# EAGLE design attiny_driver (EAGLE 6.2)
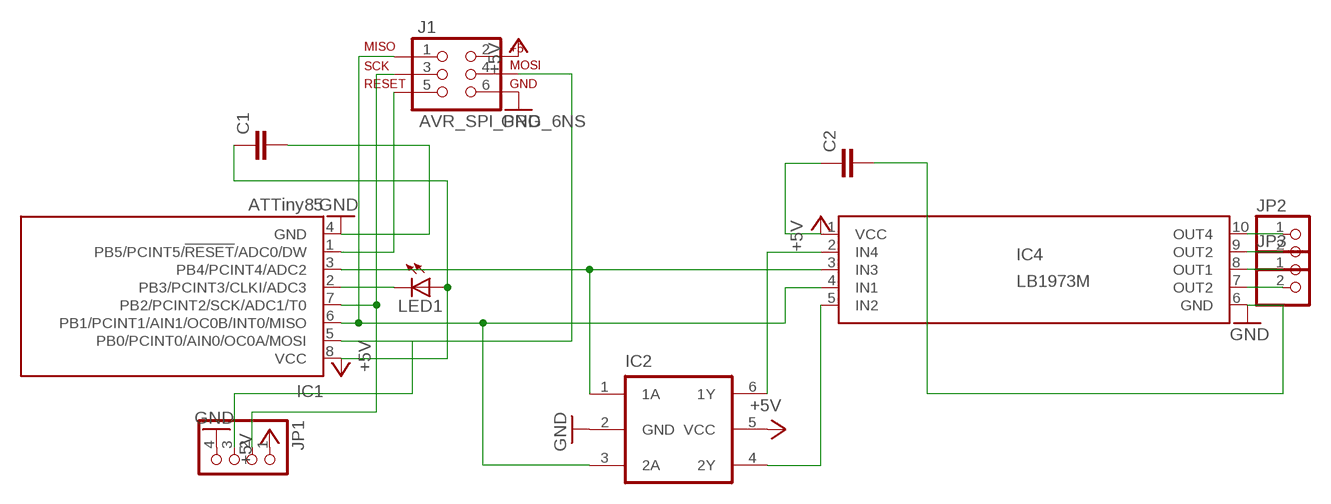
[diagram p0: schematic, sheet 1]

## Parts
C1  C-EUC0805  [C0805]
C2  C-EUC0805  [C0805]
IC1  ATTiny85  TINY13-20SU  [8S2]
IC2  IC_BUFF_SN74LVC2G17DBV  [DBV-R-PDSO-G6]
IC4  LB1973M  [SSOP10]
J1  AVR_SPI_PRG_6NS  [2X3-NS]
JP1  PINHD-1X4  [1X04]
JP2  PINHD-1X2  [1X02]
JP3  PINHD-1X2  [1X02]
LED1  LED0603  [LED-0603]

## Nets
+5V [PWR]: C1.1 C2.1 IC1.8(VCC) IC2.5(VCC) IC4.1(VCC) J1.2 JP1.1 LED1.A
GND [PWR]: C1.2 C2.2 IC1.4(GND) IC2.2(GND) IC4.6(GND) J1.6 JP1.4
IN1/MISO: IC1.6(PB1/PCINT1/AIN1/OC0B/INT0/MISO) IC2.3(2A) IC4.4(IN1) J1.1
IN2: IC2.4(2Y) IC4.5(IN2)
IN3: IC1.3(PB4/PCINT4/ADC2) IC2.1(1A) IC4.3(IN3)
IN4: IC2.6(1Y) IC4.2(IN4)
N$3: IC1.2(PB3/PCINT3/CLKI/ADC3) LED1.C
N$6: IC1.1(PB5/PCINT5/!RESET!/ADC0/DW) J1.5
OUT1 [PWR]: IC4.8(OUT1) JP3.1
OUT2 [PWR]: IC4.7(OUT2) JP3.2
OUT3 [PWR]: IC4.9(OUT2) JP2.2
OUT4 [PWR]: IC4.10(OUT4) JP2.1
SCL/SCK: IC1.7(PB2/PCINT2/SCK/ADC1/T0) J1.3 JP1.2
SDA/MOSI: IC1.5(PB0/PCINT0/AIN0/OC0A/MOSI) J1.4 JP1.3

## Library data of the parts
C1 C2 = rcl:C-EU: CAPACITOR, European symbol
IC1 = atmel:TINY13: 8-bit AVR Microcontroller with 1K Bytes In-System Programmable Flash Source: http://www.atmel.com/dyn/resources/prod_documents/2535S.pdf; MPN: ATTINY13-20SU; OC_FARNELL: 9171568; OC_NEWARK: 96K6522
IC2 = dp_devices:IC_BUFF_SN74LVC2G17
IC4 = LB1973M:LB1973M: edit this description Auto generated by make-symbol-device-package-bsdl.ulp Rev. 43 Source:
J1 = SparkFun-Connectors:AVR_SPI_PRG_6: AVR ISP 6 Pin This is the reduced ISP connector for AVR programming. Common on Arduino. This footprint will take up less PCB space and can be used with a 10-pin to 6-pin adapter such as SKU: BOB-08508
JP1 = pinhead:PINHD-1X4: PIN HEADER
JP2 JP3 = pinhead:PINHD-1X2: PIN HEADER
LED1 = SparkFun-LED:LED: LEDs Standard schematic elements and footprints for 5mm, 3mm, 1206, and 0603 sized LEDs. 5mm - Spark Fun Electronics SKU : COM-00529 (and others)

## Net classes
1 PWR: width 0.203 mm

## Board
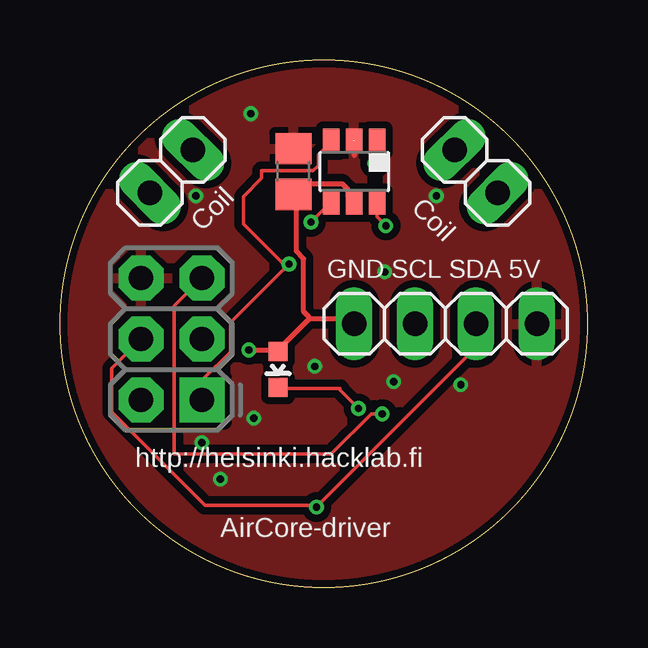
[diagram p1: board, top side]
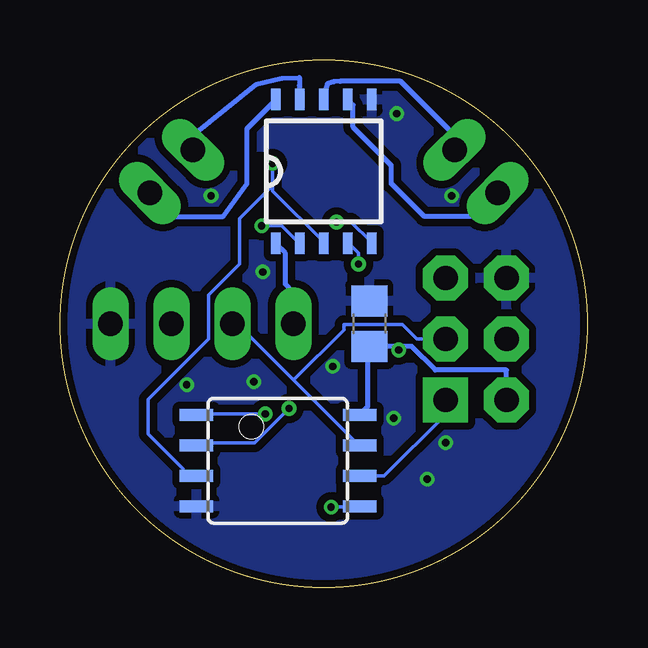
[diagram p2: board, bottom side, seen from below]

Size 22 x 22 mm. Coordinates in mm from the lower left corner, seen from the top.
Outline: circle at 11,11 radius 11
Copper layers (1*16): Top 0.035mm / dielectric 1.5mm / Bottom 0.035mm
Design rules: minimum track width 6mil, minimum drill 12mil, track to track 6mil, track to pad 6mil, pad to pad 6mil, via to via 6mil, smd to smd 0mil, copper to edge 10mil, drill to drill 10mil, minimum pad ring 10mil, minimum via ring 6mil, stop-mask expansion 2mil, vias tented up to drill 100mil, thermal gap 10mil

### Footprints (pad centres in the part's own frame; a part is rotated, then mirrored left to right if it is on the bottom)
C0805 = smd 1.3 x 1.5: 1 -0.95,0; 2 0.95,0
8S2 = smd 0.5 x 1.4: 1 -1.905,-3.404; 2 -0.645,-3.404; 3 0.625,-3.404; 4 1.895,-3.404; 5 1.905,3.404; 6 0.635,3.404; 7 -0.635,3.404; 8 -1.905,3.404
DBV-R-PDSO-G6 = smd 0.69 x 0.99: 1 -0.95,-1.29; 2 0,-1.29; 3 0.95,-1.29; 4 0.95,1.3; 5 0,1.3; 6 -0.95,1.3
SSOP10 = smd 0.9 x 0.4: 1 -2.996,2; 2 -2.996,1; 3 -2.996,0; 4 -2.996,-1; 5 -2.996,-2; 6 2.996,-2; 7 2.996,-1; 8 2.996,0; 9 2.996,1; 10 2.996,2
2X3-NS = drill 1.016 pad 1.88 square: 1 -2.54,-1.27 | drill 1.016 pad 1.88 octagon: 2 -2.54,1.27; 3 0,-1.27; 4 0,1.27; 5 2.54,-1.27; 6 2.54,1.27
1X04 = drill 1.016 long: 1 -3.81,0; 2 -1.27,0; 3 1.27,0; 4 3.81,0
1X02 = drill 1.016 long: 1 -1.27,0; 2 1.27,0
LED-0603 = smd 0.8 x 0.8: A 0,-0.75; C 0,0.75

### Placement (x,y rotation side)
C1  9.1,11 90 bottom
C2  9.73,17.35 90 top
IC1  12.91,5.29 270 bottom
IC2  12.27,17.35 180 top
IC4  11,17.35 90 bottom
J1  4.65,10.37 90 top
JP1  16.08,11 0 top
JP2  17.35,17.35 135 top
JP3  4.65,17.35 225 top
LED1  9.1,9.1 180 top

### Tracks (layer width: path | path; a pad name or v marks a point on that pad's centre or on a via)
+5V  (via drill 0.3)
  Top 0.203: IC2.5 12.22,16.08 11.99,16.31 11.99,16.61 11.76,16.84 9.78,16.84 9.78,16.46 C2.1 9.78,16.31 9.86,16.23 9.86,14.02 10.16,13.72 10.16,11.51 10.39,11.28 10.39,11.2 | 10.39,11.2 9.1,9.91 LED1.A 9.02,9.91 v7.88,9.91 | 10.39,11.2 12.22,11.2 12.22,11.05 JP1.1
  Bottom 0.203: IC4.1 12.98,14.33 12.6,13.95 12.6,12.65 12.29,12.35 12.29,11.05 JP1.1 | IC1.8 9.48,7.24 9.17,7.55 9.17,9.91 9.1,9.98 C1.1 9.02,10.06 7.88,10.06 | 7.88,10.06 7.34,10.06 6.35,9.07 3.38,9.07 J1.2 | v7.88,9.91 7.88,10.06
GND  (via drill 0.3)
  Top 0.203: IC2.2 12.29,18.59 12.29,18.21 12.27,18.01
  other vias: 16.71,8.46 13.92,8.59 6.68,4.52 10.62,9.22 7.95,19.76 15.7,16.33 13.54,13.16 5.92,6.05 8.08,7.06 5.67,16.33
  pour Bottom (isolate 0.305): 22.43,22.43 -0.43,22.43 -0.43,-0.43 22.43,-0.43
  pour Top (isolate 0.305): -1.7,22.43 -1.7,-0.43 22.43,-0.43 22.43,22.43
IN1/MISO  (via drill 0.3)
  Top 0.152: J1.1 5.97,7.85 5.97,8.69 7.11,9.83 7.11,11.05 v9.55,13.49 9.4,13.41 7.65,15.17 7.65,16.31 8.41,17.07 8.41,17.38 10.54,17.38 10.77,17.6 10.77,18.06 11.3,18.59 IC2.3
  Bottom 0.152: v9.55,13.49 9.55,13.95 9.93,14.33 IC4.4 | IC1.6 8.49,4.65 5.97,7.17 5.97,7.77 J1.1
IN2  (via drill 0.3)
  Top 0.152: v10.47,15.24 11.3,16.08 IC2.4
  Bottom 0.152: v10.47,15.24 9.86,15.24 9.02,14.4 IC4.5
IN3  (via drill 0.3)
  Top 0.152: v13.13,17.68 13.21,17.76 13.21,18.59 IC2.1
  Bottom 0.152: v13.13,17.68 13.13,16.77 | 13.13,16.77 13.13,16.54 11,14.4 IC4.3 | 13.13,16.77 14.5,15.39 14.5,13.49 15.8,12.19 15.8,10.37 18.32,7.85 18.32,6.4 16.87,4.96 16.87,4.73 16.33,4.73 IC1.3
IN4  (via drill 0.3)
  Top 0.152: v13.59,15.09 13.21,15.47 13.21,16 IC2.6
  Bottom 0.152: v13.59,15.09 12.75,15.09 12.07,14.4 IC4.2
N$3  (via drill 0.3)
  Top 0.152: v12.45,7.47 11.69,8.23 11.69,8.31 9.1,8.31 LED1.C
  Bottom 0.152: v12.45,7.47 13.9,6.02 16.26,6.02 16.26,5.95 IC1.2
N$6  (via drill 0.3)
  Top 0.152: v13.44,7.24 12.98,7.24 11.3,5.56 4.75,5.56 4.75,11.74 J1.5
  Bottom 0.152: v13.44,7.24 16.26,7.24 IC1.1
OUT1
  Bottom 0.203: IC4.8 11,20.6 10.85,21.01 10.59,21.08 10.31,21.11 7.8,21.11 5.59,18.9 5.59,18.29 JP3.1
OUT2
  Bottom 0.203: IC4.7 9.93,20.27 9.78,20.12 9.78,19.2 8.18,17.6 8.18,16.84 6.81,15.47 3.76,15.47 3.76,16.39 JP3.2
OUT3
  Bottom 0.203: IC4.9 12.07,20.35 12.02,20.93 12.02,21.26 12.75,21.24 13.82,20.98 16.41,18.9 16.41,18.29 JP2.2
OUT4
  Bottom 0.203: IC4.10 13.06,20.27 14.2,19.13 14.2,16.84 15.19,15.47 18.24,15.47 18.24,16.39 JP2.1
SCL/SCK
  Bottom 0.152: 12.26,8.65 14.58,10.97 14.81,10.97 JP1.2 | 12.26,8.65 9.55,5.95 IC1.7 | J1.3 7.11,10.37 7.72,10.97 10.16,10.97 10.16,10.75 12.26,8.65
SDA/MOSI  (via drill 0.3)
  Top 0.152: JP1.3 17.32,10.97 17.32,9.98 v10.7,3.36 10.7,3.43 6.05,3.43 2.16,7.32 2.16,9.15 J1.4
  Bottom 0.152: v10.7,3.36 9.55,3.36 IC1.5

### Text on the board
tPlace: Coil | Coil | http://helsinki.hacklab.fi | AirCore-driver
tNames: GND SCL SDA 5V